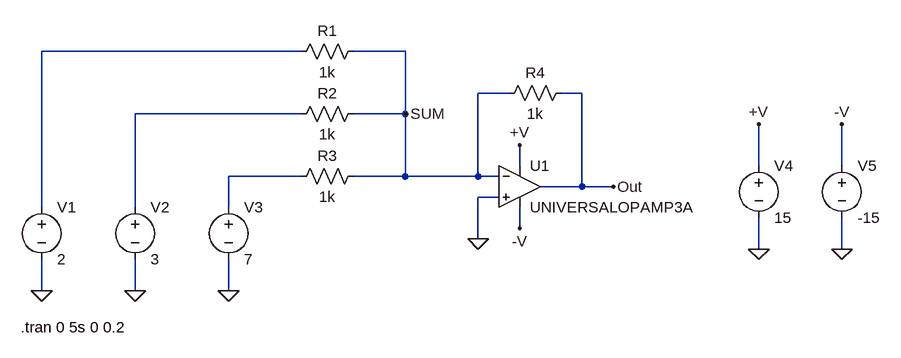
[diagram p0: schematic Summer.asc]
Summer.asc, the LTspice schematic file:
Version 4
SHEET 1 1380 680
WIRE 480 -96 80 -96
WIRE 640 -96 560 -96
WIRE 800 -32 752 -32
WIRE 912 -32 880 -32
WIRE 480 0 224 0
WIRE 640 0 640 -96
WIRE 640 0 560 0
WIRE 816 80 816 48
WIRE 1184 80 1184 16
WIRE 1312 80 1312 16
WIRE 480 96 368 96
WIRE 640 96 640 0
WIRE 640 96 560 96
WIRE 752 96 752 -32
WIRE 752 96 640 96
WIRE 784 96 752 96
WIRE 912 112 912 -32
WIRE 912 112 848 112
WIRE 960 112 912 112
WIRE 784 128 752 128
WIRE 80 144 80 -96
WIRE 224 144 224 0
WIRE 368 144 368 96
WIRE 816 176 816 144
WIRE 752 192 752 128
WIRE 1184 208 1184 160
WIRE 1312 208 1312 160
WIRE 80 272 80 224
WIRE 224 272 224 224
WIRE 368 272 368 224
FLAG 224 272 0
FLAG 368 272 0
FLAG 80 272 0
FLAG 752 192 0
FLAG 960 112 Out
FLAG 816 48 +V
FLAG 816 176 -V
FLAG 640 0 SUM
FLAG 1184 208 0
FLAG 1312 208 0
FLAG 1184 16 +V
FLAG 1312 16 -V
SYMBOL voltage 80 128 R0
WINDOW 123 0 0 Left 0
WINDOW 39 0 0 Left 0
SYMATTR InstName V1
SYMATTR Value 2
SYMBOL voltage 224 128 R0
WINDOW 123 0 0 Left 0
WINDOW 39 0 0 Left 0
SYMATTR InstName V2
SYMATTR Value 3
SYMBOL voltage 368 128 R0
WINDOW 123 0 0 Left 0
WINDOW 39 0 0 Left 0
SYMATTR InstName V3
SYMATTR Value 7
SYMBOL res 576 -112 R90
WINDOW 0 0 56 VBottom 2
WINDOW 3 32 56 VTop 2
SYMATTR InstName R1
SYMATTR Value 1k
SYMBOL res 576 -16 R90
WINDOW 0 0 56 VBottom 2
WINDOW 3 32 56 VTop 2
SYMATTR InstName R2
SYMATTR Value 1k
SYMBOL res 576 80 R90
WINDOW 0 0 56 VBottom 2
WINDOW 3 32 56 VTop 2
SYMATTR InstName R3
SYMATTR Value 1k
SYMBOL OpAmps\\UniversalOpAmp3a 816 112 R0
SYMATTR InstName U1
SYMBOL res 896 -48 R90
WINDOW 0 0 56 VBottom 2
WINDOW 3 32 56 VTop 2
SYMATTR InstName R4
SYMATTR Value 1k
SYMBOL voltage 1184 64 R0
WINDOW 123 0 0 Left 0
WINDOW 39 0 0 Left 0
SYMATTR InstName V4
SYMATTR Value 15
SYMBOL voltage 1312 64 R0
WINDOW 123 0 0 Left 0
WINDOW 39 0 0 Left 0
SYMATTR InstName V5
SYMATTR Value -15
TEXT 48 328 Left 2 !.tran 0 5s 0 0.2

The netlist it stands for:
* Summer.asc
V1 N001 0 2
V2 N002 0 3
V3 N003 0 7
R1 SUM N001 1k
R2 SUM N002 1k
R3 SUM N003 1k
XU1 0 SUM +V -V Out level3a Avol=1Meg GBW=10Meg Slew=10Meg Ilimit=25m Rail=0 Vos=0 Phimargin=45 En=0 Enk=0 In=0 Ink=0 Rin=500Meg  ; UNIVERSALOPAMP3A, pins In+ In- V+ V- OUT
R4 Out SUM 1k
V4 +V 0 15
V5 -V 0 -15
.tran 0 5s 0 0.2
.backanno
.end